# Altium schematic sheet LFO.SchDoc: Low Frequency Oscillator
size Letter; SheetNumber: 5; SheetTotal: 10
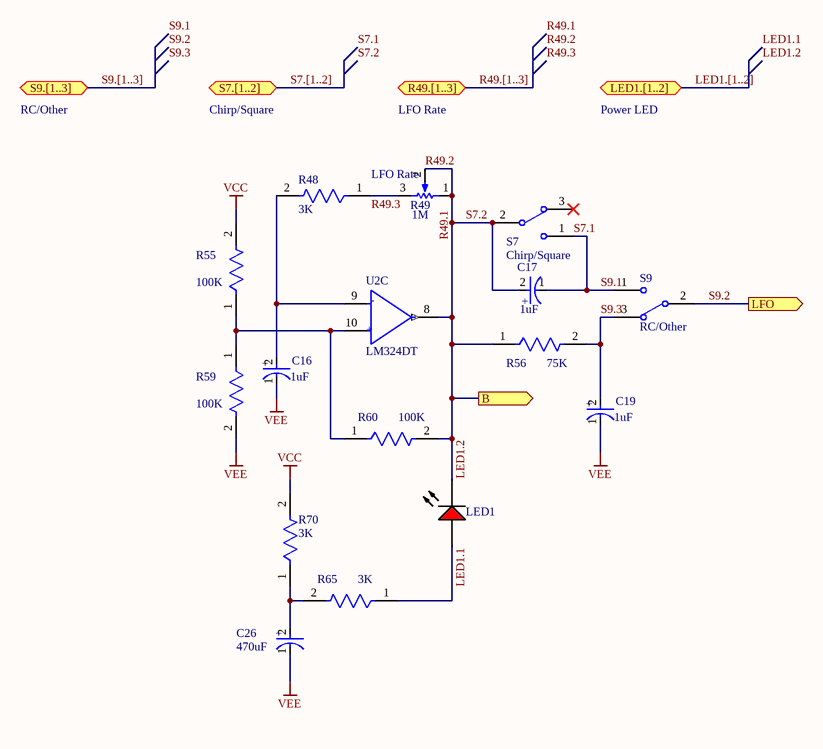
[diagram p0: LFO.SchDoc]

## Parts
C16  Capacitance: 1uF  [FP-OS-CON-SMT-A5-MFG]  (hidden comment: ‎865060640001‎)
C17  Capacitance: 1uF  [FP-OS-CON-SMT-A5-MFG]  (hidden comment: EEE-1HA010NR)
C19  Capacitance: 1uF  [FP-OS-CON-SMT-A5-MFG]  (hidden comment: ‎865060640001‎)
C26  Capacitance: 470uF  [FP-FTF-MFG]
LED1  C503B-RAN-CY0B0AA2  [CREE-C503B-RAN]  (value not drawn)  (graphical)
R48  Resistance: 3K  [FP-ESR03-IPC_B]  (hidden comment: ESR03EZPJ302)
R49  LFO Rate  value 1M  [VR5]  (graphical)
R55  Resistance: 100K  [FP-ESR03-IPC_B]  (hidden comment: ESR03EZPJ104)
R56  Resistance: 75K  [FP-ESR03-IPC_B]  (hidden comment: ESR03EZPJ753)
R59  Resistance: 100K  [FP-ESR03-IPC_B]  (hidden comment: ESR03EZPJ104)
R60  Resistance: 100K  [FP-ESR03-IPC_B]  (hidden comment: ESR03EZPJ104)
R65  Resistance: 3K  [FP-ESR03-IPC_B]  (hidden comment: ESR03EZPJ302)
R70  Resistance: 3K  [FP-ESR03-IPC_B]  (hidden comment: ESR03EZPJ302)
S7  Chirp/Square  [HDR1X3]
S9  RC/Other  [HDR1X3]  (graphical)
U2  LM324DT  [FP-SO-14-MFG]  (part C of 4)

## Ports
B (out), LED1.[1..2] (bidir), LFO (out), R49.[1..3] (bidir), S7.[1..2] (bidir), S9.[1..3] (bidir)

## Nets
VCC: R55.2 R70.2
VEE: C16.1(C) C19.1(C) C26.1(C) R59.2
LED1.1: LED1.1(A) R65.1
LED1.2: C17.2(A) LED1.2(K) R49.1(TOP) R49.2(TAP) R56.1 R60.2 S7.2 U2.8(Output_3) ; port B  [also labelled R49.1, R49.2, S7.2]
R49.3: R48.1 R49.3(BOT)
S7.1: C17.1(C) S7.1 S9.1  [also labelled S9.1]
S9.2: S9.2 ; port LFO
S9.3: C19.2(A) R56.2 S9.3
NetC16_2: C16.2(A) R48.2 U2.9(Inverting_Input_3)
NetC26_2: C26.2(A) R65.2 R70.1
NetR55_1: R55.1 R59.1 R60.1 U2.10(Non-Inverting_Input_3)

Not connected (* = marked no-connect by the designer): S7 3*

## Buses and harness runs
bus LED1.[1..2] = port LED1.[1..2]
bus R49.[1..3] = port R49.[1..3]
bus S7.[1..2] = port S7.[1..2]
bus S9.[1..3] = port S9.[1..3]

## Notes on the sheet
- RC/Other
- Chirp/Square
- LFO Rate
- Power LED
- Labels drawn without touching a wire or pin: LED1.1, LED1.2, R49.1, R49.2, R49.3, S7.1, S7.2, S9.1, S9.2, S9.3
- (in symbol CMP-05427-000040-1) +
- (in symbol CMP-05427-000158-1) +
- (in symbol CMP-12131-000005-1, part C) -; +

## Library data of the parts
C16 C19 = CMP-05427-000158-1: Manufacturer: Wurth Electronics; Voltage Rating: 50V; Polarity: Polar; Ripple Current: 60mA; Impedance: 2.9R; Life (Hours): 2000Hour; Tolerance: 20%; Supplier 1: RSComponents; Supplier Part Number 1: 8395602; Manufacturer Part Number: 865060640001; RoHS: Yes; Category: Aluminum Electrolytic Capacitors; Stock 1: 1; Pricing 1: 25=0.16200, 125=0.11600, 250=0.10400, 500=0.09300 (USD); Mount: Surface Mount; Case/Package: Radial; Min Operating Temperature: -55°C; Max Operating Temperature: 105°C; Package Quantity: 2000; Packaging: Cut Tape; Ripple Current (AC): 60mA; Voltage Rating (DC): 50V; Diameter: 4mm; Height: 5.5mm; Height - Seated (Max): 0.217inch; REACH SVHC: Unknown; ComponentLink1URL: http://www.farnell.com/datasheets/1880069.pdf?src-supplier=Farnell; ComponentLink1Description: http://www.farnell.com/datasheets/1880069.pdf?src-supplier=Farnell; ComponentLink2URL: http://www.farnell.com/datasheets/1880069.pdf?src-supplier=Element14; ComponentLink2Description: http://www.farnell.com/datasheets/1880069.pdf?src-supplier=Element14; ComponentLink3URL: http://www.farnell.com/datasheets/1880069.pdf?src-supplier=Newark; ComponentLink3Description: http://www.farnell.com/datasheets/1880069.pdf?src-supplier=Newark; ComponentLink4URL: http://katalog.we-online.de/pbs/datasheet/865060640001.pdf?src-supplier=Digi-Key; ComponentLink4Description: http://katalog.we-online.de/pbs/datasheet/865060640001.pdf?src-supplier=Digi-Key; ComponentLink5URL: https://katalog.we-online.de/pbs/datasheet/865060640001.pdf?src-supplier=Digi-Key; ComponentLink5Description: https://katalog.we-online.de/pbs/datasheet/865060640001.pdf?src-supplier=Digi-Key
C17 = CMP-05427-000158-1: CAP ALUM POLY 10UF 20% 10V SMD Non-Polarized; Manufacturer: Panasonic; Voltage Rating: 50V; Ripple Current: 10mA; Life (Hours): 2000Hour; ComponentLink1URL: https://datasheet.ciiva.com/24228/aba0000ce2-40801-24228231.pdf?src-supplier=Mouser; ComponentLink1Description: https://datasheet.ciiva.com/24228/aba0000ce2-40801-24228231.pdf?src-supplier=Mouser; ComponentLink2URL: https://datasheet.ciiva.com/14604/70255710-14604079.pdf?src-supplier=Allied+Electronics; ComponentLink2Description: https://datasheet.ciiva.com/14604/70255710-14604079.pdf?src-supplier=Allied+Electronics; ComponentLink3URL: https://datasheet.ciiva.com/14597/70255710-14597097.pdf?src-supplier=Allied+Electronics; ComponentLink3Description: https://datasheet.ciiva.com/14597/70255710-14597097.pdf?src-supplier=Allied+Electronics; ComponentLink4URL: https://datasheet.ciiva.com/16396/aba0000ce2-16396566.pdf?src-supplier=Future+Electronics; ComponentLink4Description: https://datasheet.ciiva.com/16396/aba0000ce2-16396566.pdf?src-supplier=Future+Electronics; ComponentLink5URL: https://datasheet.ciiva.com/30244/11aba0000ce2-30244199.pdf?src-supplier=Onlinecomponents.com; ComponentLink5Description: https://datasheet.ciiva.com/30244/11aba0000ce2-30244199.pdf?src-supplier=Onlinecomponents.com; Supplier 1: Mouser; Supplier Part Number 1: 667-EEE-1HA010NR; Manufacturer Part Number: EEE-1HA010NR; RoHS: Yes; Category: Aluminum Electrolytic Capacitors; Stock 1: 556; Pricing 1: 1=0.50000, 10=0.34500, 50=0.24200, 100=0.20700, 1000=0.15300, 10000=0.12100 (USD); Mount: Surface Mount,PCB; Case/Package: Radial; Contact Plating: Tin; Min Operating Temperature: -40°C; Max Operating Temperature: 85°C; Packaging: Tape and Reel; Tolerance: 20%; Voltage Rating (DC): 50V; Package Quantity: 1; Termination: SMD/SMT; Series: S; Construction: Cylindrical; Ripple Current (AC): 10mA; Diameter: 4mm; Length: 5.5mm; Width: 650um; Height: 5.4mm; Height - Seated (Max): 0.213inch; Radiation Hardening: No; RoHS Compliant: Yes; REACH SVHC: Unknown; Lead Free: Lead Free
C26 = CMP-05427-000040-1: Manufacturer: Wurth Electronics; Manufacturer Part Number: 865080353015; Voltage Rating: 16V; Polarity: Polar; Ripple Current: 590mA; Impedance: 220mR; Life (Hours): 2000Hour; Tolerance: 20%; Supplier 1: Digi-Key; Supplier Part Number 1: 732-8425-1-ND; RoHS: Yes; Category: Aluminum Electrolytic Capacitors; Stock 1: 263; Pricing 1: 1=0.63000, 50=0.53700, 100=0.46700, 250=0.41600 (USD); Mount: Surface Mount; Case/Package: Radial; Min Operating Temperature: -55°C; Max Operating Temperature: 105°C; Package Quantity: 500; Packaging: Cut Tape; Ripple Current (AC): 590mA; Voltage Rating (DC): 16V; Diameter: 8mm; Height: 10.5mm; Height - Seated (Max): 0.413inch; REACH SVHC: Unknown; RoHS Compliant: Yes; ComponentLink1URL: http://www.farnell.com/datasheets/1880132.pdf?src-supplier=Farnell; ComponentLink1Description: http://www.farnell.com/datasheets/1880132.pdf?src-supplier=Farnell; ComponentLink2URL: http://www.farnell.com/datasheets/1880132.pdf?src-supplier=Element14; ComponentLink2Description: http://www.farnell.com/datasheets/1880132.pdf?src-supplier=Element14; ComponentLink3URL: https://katalog.we-online.de/pbs/datasheet/865080353015.pdf?src-supplier=Digi-Key; ComponentLink3Description: https://katalog.we-online.de/pbs/datasheet/865080353015.pdf?src-supplier=Digi-Key; ComponentLink4URL: http://katalog.we-online.de/pbs/datasheet/865080353015.pdf?src-supplier=Digi-Key; ComponentLink4Description: http://katalog.we-online.de/pbs/datasheet/865080353015.pdf?src-supplier=Digi-Key
LED1 = CMP-2000-06058-1: Cree(R) 5-mm Red Round LED, 2.1 V, -40 to 100 degC, 2-Pin THD, RoHS, Ammo; Manufacturer Part Number: C503B-RAS-CA0C0AA1; Forward Current: 50mA; Product Depth (mm): 5.8mm; Power Dissipation: 130mW; Viewing Angle: 15°; Test Current (It): 20mA; Type: Uni-Color; Shape Type: Circular; Product Height (mm): 8.8mm; Luminous Intensity: 12000mcd; Main Category: StandardLED; Forward Voltage: 2.6V; Number of  Elements: 1; Dominant Wave Length: 624nm; Reverse Voltage: 5V; Lens Color: Colorless; Lens Style: Round,Domed; Lens Transparency: Clear; Lens Size: 5mm; Mounting Technology: ThroughHole; Datasheet Version: 12/2014; Manufacturer URL: http://www.cree.com/; Packaging: AmmoPack; Operating Temperature Classification: Industrial; Package Description: 2-Pin Through Hole Device, Dia 5.8 mm, Pitch 2.54 mm; Package Reference: C503B-RAN; Product Length (mm): 5.8mm; Datasheet URL: http://www.cree.com/sitecore-modules/web/~/media/Files/Cree/LED-Components-and-Modules/HB/Data-Sheets/C503B-RAS-RAN-AAS-AAN-RBS-RBN-ABS-ABN-RCS-RCN-ACS-ACN-1079.pdf; Operating Temp Range: -40Cto100C; Manufacturer: Cree; Mounting: ThroughHole; Emitting Color: Red; Lens Dimensions: 5x5x7.8mm; Package Type: T-13/4; Pin Count: 2; Supplier 1: Digi-Key; Supplier Part Number 1: C503B-RAS-CA0C0AA1-ND; RoHS: Yes; Category: LEDs; Stock 1: 3361; Pricing 1: 1=0.16000, 10=0.14500, 100=0.13420, 1000=0.12000, 50000=0.11143 (USD); Mount: Through Hole; Case/Package: Radial; Color: Red; Test Current: 20mA; Dominant Wavelength: 624nm; Height: 13.3mm; RoHS Compliant: Yes; ComponentLink1URL: https://www.cree.com/led-components/media/documents/C503B-RAS-RAN-AAS-AAN-RBS-RBN-ABS-ABN-RCS-RCN-ACS-ACN-1079.pdf?src-supplier=Digi-Key; ComponentLink1Description: https://www.cree.com/led-components/media/documents/C503B-RAS-RAN-AAS-AAN-RBS-RBN-ABS-ABN-RCS-RCN-ACS-ACN-1079.pdf?src-supplier=Digi-Key
R48 R65 R70 = CMP-08839-028498-1: 3kΩ ±5% 0.25W 0603 Anti-Surge Chip Resistor AEC-Q200; Temperature Coefficient: 200ppm/°C; Max Power Dissipation: 250mW; Package Quantity: 5000; Case/Package: 0603; Number of Terminations: 2; RoHS Compliant: Yes; Height: 0.022inch; Packaging: Tape and Reel; Min Operating Temperature: -55°C; Max Operating Temperature: 155°C; Series: ESR; Case Code (Metric): 1608; Features: Automotive AEC-Q200; Width: 0.031inch; Case Code (Imperial): 0603; Length: 0.063inch; Resistor Type: Thick Film; Tolerance: 5%
R49 = RPot: Potentiometer; Sim Note: Enter the Resistance value and the set point into parameter fields.; Set Position: 0.5; Published: 8-Jun-2000; LatestRevisionDate: 17-Jul-2002; LatestRevisionNote: Re-released for DXP Platform.; PackageReference: VR5; Publisher: Altium Limited; PackageDescription: Variable Resistor, Thru-Hole; 3 Leads
R55 R59 R60 = CMP-08839-029521-1: 100kΩ ±5% 0.25W 0603 Anti-Surge Chip Resistor AEC-Q200; Power Rating: 200mW; Max Power Dissipation: 250mW; Temperature Coefficient: 200ppm/°C; Length: 0.063inch; Case Code (Imperial): 0603; Case/Package: 0603; Resistor Type: Thick Film; Features: Automotive AEC-Q200; Package Quantity: 1; Width: 0.031inch; Packaging: Cut Tape; Min Operating Temperature: -55°C; Series: ESR; RoHS Compliant: Yes; Size Code: 0603; Tolerance: 5%; Height: 0.022inch; Max Operating Temperature: 155°C; Lead Free: Lead Free; Case Code (Metric): 1608; Number of Terminations: 2
R56 = CMP-08839-028281-1: 75kΩ ±5% 0.25W 0603 Anti-Surge Chip Resistor AEC-Q200; Temperature Coefficient: 200ppm/°C; Max Power Dissipation: 250mW; Min Operating Temperature: -55°C; Number of Terminations: 2; Tolerance: 5%; Height: 0.022inch; Case Code (Metric): 1608; Width: 0.031inch; Case Code (Imperial): 0603; Package Quantity: 5000; Length: 0.063inch; Series: ESR; RoHS Compliant: Yes; Resistor Type: Thick Film; Packaging: Tape and Reel; Features: Automotive AEC-Q200; Max Operating Temperature: 155°C; Case/Package: 0603
S7 S9 = SW-SPDT: Switch Toggle ON None ON SPDT Round Lever Solder Lug 5A 250VAC 28VDC Panel Mount with Threads; Manufacturer: E-Switch; Manufacturer Part Number: 100SP1T1B1M1QEH; Actuator Material: Brass,Chrome; Actuator Color: Chrome; Voltage Rating (AC): 120V; Voltage Rating (DC): 28V; Max Voltage Rating (AC): 250V; Illumination Type: Illuminated,Non-Illuminated; Switch Function: On-On; Actuator Type: Standard Round; Contact Resistance: 100mR; Electrical Life: 40000Cycles; Actuator Length: 10.41mm; Supplier 1: Newark; Supplier Part Number 1: 15N9971; RoHS: Yes; Category: Toggle Switches; Stock 1: 978; Pricing 1: 1=3.08000, 10=2.76000, 25=2.61000, 50=2.49000, 100=2.37000 (USD); Mount: Panel; Contact Material: Copper Alloy,Silver; Contact Plating: Silver; Housing Material: Stainless Steel; Min Operating Temperature: -30°C; Max Operating Temperature: 85°C; Throw Configuration: SPDT; Current Rating: 5A; Package Quantity: 1; Packaging: Bulk; Max Voltage Rating (DC): 28V; Termination: Solder; Orientation: Straight; Series: 100; REACH SVHC: No SVHC; Lead Free: Lead Free; RoHS Compliant: Yes; ComponentLink1URL: https://datasheet.ciiva.com/2904/st110007c-2904798.pdf?src-supplier=Digi-Key; ComponentLink1Description: https://datasheet.ciiva.com/2904/st110007c-2904798.pdf?src-supplier=Digi-Key; ComponentLink2URL: https://datasheet.ciiva.com/16154/xt0157p-16154561.pdf?src-supplier=Onlinecomponents.com; ComponentLink2Description: https://datasheet.ciiva.com/16154/xt0157p-16154561.pdf?src-supplier=Onlinecomponents.com; ComponentLink3URL: https://datasheet.ciiva.com/16347/100-16347391.pdf?src-supplier=Future+Electronics; ComponentLink3Description: https://datasheet.ciiva.com/16347/100-16347391.pdf?src-supplier=Future+Electronics
U2 = CMP-12131-000005-1: IC OPAMP GP 4 CIRCUIT 14SO; Manufacturer: STMicroelectronics; Voltage Gain: 100dB; Standoff Height: 0.1mm; Bandwidth: 1.3MHz; Max Junction Temp: +150°C; Min Supply Voltage: 3V; Max Dual Supply Voltage: 15V; Min Dual Supply Voltage: 1.5V; Number Of Channels: 4; Nominal Supply Current: 0.7-1.5mA; Output Current Per Channel: 20-50mA; Max Supply Voltage: 30V; Input Offset Voltage: 2mV; Input Bias Current: 0.02uA; Device Class L1: Integrated Circuits (ICs); Device Class L3: Amplifiers - Op Amps; Temperature Range Low: 0°C; Package: SO-14; Temperature Range High: +70°C; Digikey Description: IC OPAMP GP 4 CIRCUIT 14SO; Device Class L2: Linear ICs; Footprint Url: https://www.st.com/content/ccc/resource/technical/document/datasheet/group3/10/8a/e6/12/f8/e8/49/ce/DM00366438/files/DM00366438.pdf/jcr:content/translations/en.DM00366438.pdf; Octopart: https://octopart.com/lm324dt-stmicroelectronics-39579146; ComponentLink2URL: https://www.st.com/content/ccc/resource/technical/document/datasheet/bd/fc/46/43/26/8f/40/7f/CD00001046.pdf/files/CD00001046.pdf/jcr:content/translations/en.CD00001046.pdf; ComponentLink2Description: Datasheet; Lead Free: Yes; Temperature: 0°C to +70°C; RoHS: TRUE; Gain Bandwidth: 1.3MHz; Manufacturer Part Number: LM324DT; Automotive: No; Category: IC; Height: 1.75mm; Mouser Description: LM324 Series 32 V 1.3 MHz Low Power Quad Operational Amplifier - SOIC-14